# EAGLE design W501D (EAGLE 6.6.0)
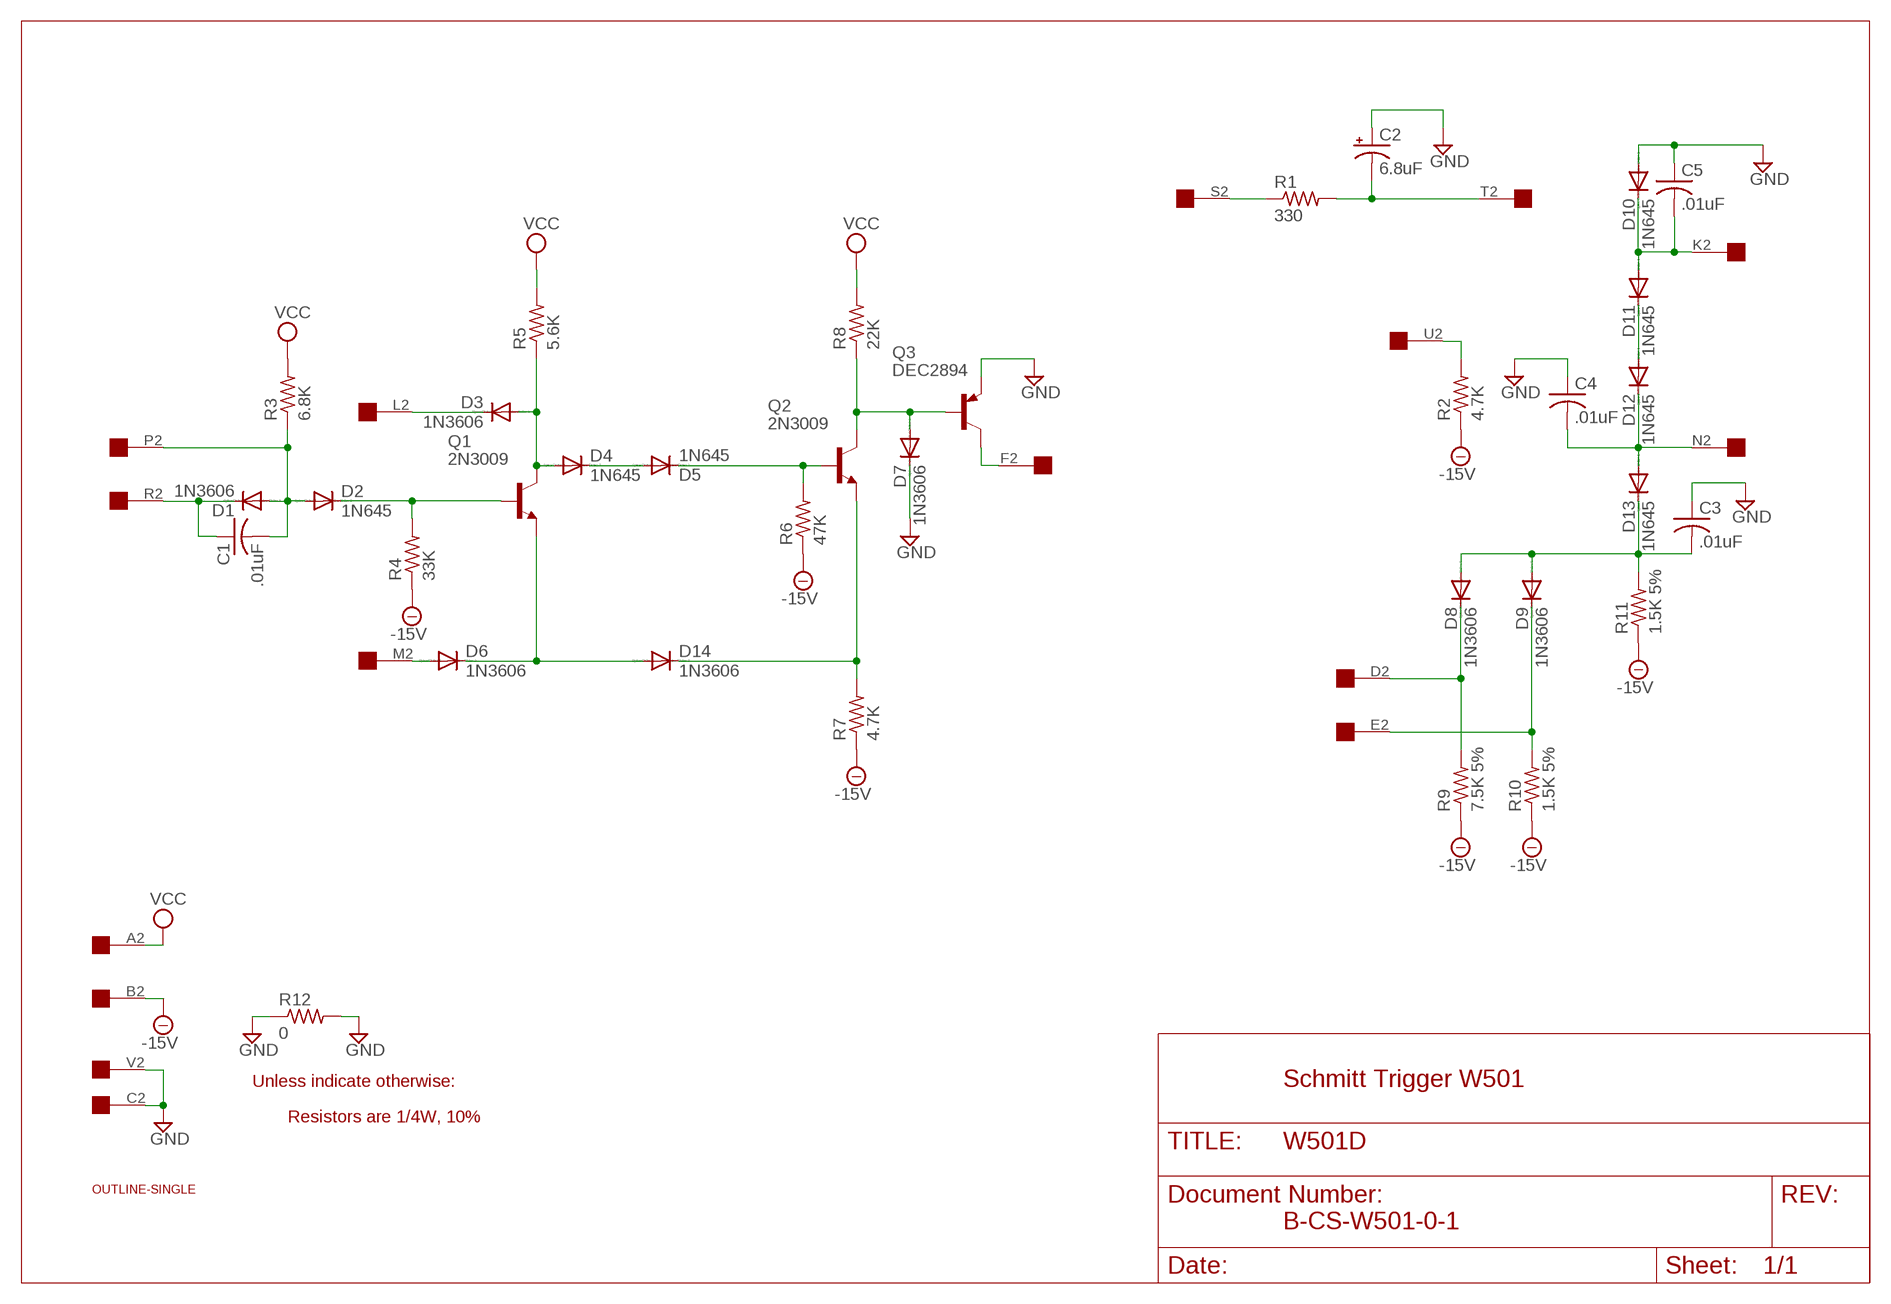
[diagram p0: schematic, sheet 1]

## Parts
C1  .01uF  C-US075-032X103  [C075-032X103]
C2  6.8uF  CPOL-USE20-8AXIAL  [E12-8]
C3  .01uF  C-US  [C063-025X075]
C4  .01uF  C-US  [C063-025X075]
C5  .01uF  C-US  [C063-025X075]
D1  1N3606  1N4148DO35-10  [DO35-10]
D2  1N645  1N4148DO35-10  [DO35-10]
D3  1N3606  1N4148DO35-10  [DO35-10]
D4  1N645  1N4148DO35-10  [DO35-10]
D5  1N645  1N4148DO35-10  [DO35-10]
D6  1N3606  1N4148DO35-10  [DO35-10]
D7  1N3606  1N4148DO35-10  [DO35-10]
D8  1N3606  1N4148DO35-10  [DO35-10]
D9  1N3606  1N4148DO35-10  [DO35-10]
D10  1N645  1N4148DO35-10  [DO35-10]
D11  1N645  1N4148DO35-10  [DO35-10]
D12  1N645  1N4148DO35-10  [DO35-10]
D13  1N645  1N4148DO35-10  [DO35-10]
D14  1N3606  1N4148DO35-10  [DO35-10]
EDGE  EDGE-1  [EDGE-CON1]
Q1  2N3009  2N2102  [TO5]
Q2  2N3009  2N2102  [TO5]
Q3  DEC2894  2N2904  [TO39]
R1  330  R-US_0207/10  [0207/10]
R2  4.7K  R-US_0207/10  [0207/10]
R3  6.8K  R-US_0207/10  [0207/10]
R4  33K  R-US_0207/10  [0207/10]
R5  5.6K  R-US_0207/10  [0207/10]
R6  47K  R-US_0207/10  [0207/10]
R7  4.7K  R-US_0207/10  [0207/10]
R8  22K  R-US_0207/10  [0207/10]
R9  7.5K 5%  R-US_0207/10  [0207/10]
R10  1.5K 5%  R-US_0207/10  [0207/10]
R11  1.5K 5%  R-US_0207/10  [0207/10]
R12  0  R-US_0207/10  [0207/10]
U$1  OUTLINE-SINGLE  [SINGLE]

## Nets
-15V [Supply]: EDGE.B2 R2.1 R4.1 R6.1 R7.1 R9.1 R10.1 R11.1
GND [Supply]: C2.+ C3.1 C4.1 C5.1 D7.C D10.A EDGE.C2 EDGE.V2 Q3.1(E) R12.1 R12.2
N$2: C2.- EDGE.T2 R1.2
N$3: EDGE.S2 R1.1
N$4: C5.2 D10.C D11.A EDGE.K2
N$5: D11.C D12.A
N$6: C4.2 D12.C D13.A EDGE.N2
N$7: C3.2 D8.A D9.A D13.C R11.2
N$8: D8.C EDGE.D2 R9.2
N$9: D9.C EDGE.E2 R10.2
N$10: EDGE.U2 R2.2
N$11: EDGE.F2 Q3.3(C)
N$13: D7.A Q2.3(C) Q3.2(B) R8.1
N$14: D14.C Q2.1(E) R7.2
N$15: D6.C D14.A Q1.1(E)
N$16: D3.A D4.A Q1.3(C) R5.1
N$17: D5.C Q2.2(B) R6.2
N$18: D3.C EDGE.L2
N$19: D6.A EDGE.M2
N$20: C1.2 D1.A D2.A EDGE.P2 R3.1
N$21: C1.1 D1.C EDGE.R2
N$22: D2.C Q1.2(B) R4.2
N$23: D4.C D5.A
VCC [Supply]: EDGE.A2 R3.2 R5.2 R8.2
Unconnected: EDGE.H2 EDGE.J2

## Notes on the sheet
- Unless indicate otherwise: | Schmitt Trigger W501
- Resistors are 1/4W, 10%
- B-CS-W501-0-1

## Library data of the parts
C1 = rcl:C-US: CAPACITOR, American symbol
C2 = dec-con:CPOL-USE20-8AXIAL: A 0.8 inch electrolytic.
C3-C5 = dec-con:C-US: Capacitors with funky DEC lead spacing.
D1-D14 = diode:1N4148: DIODE high speed (Philips)
EDGE = dec-con:EDGE-1: Single-Sided DEC Edge Connector -- (side 2)
Q1 Q2 = transistor-npn:2N2102: NPN Transistor
Q3 = transistor-pnp:2N2904*: PNP Transistror
R1-R12 = rcl:R-US_: RESISTOR, American symbol
U$1 = dec-con:OUTLINE-*: Board outlines for DEC boards.

## Net classes
1 Supply: width 0.813 mm

## Board
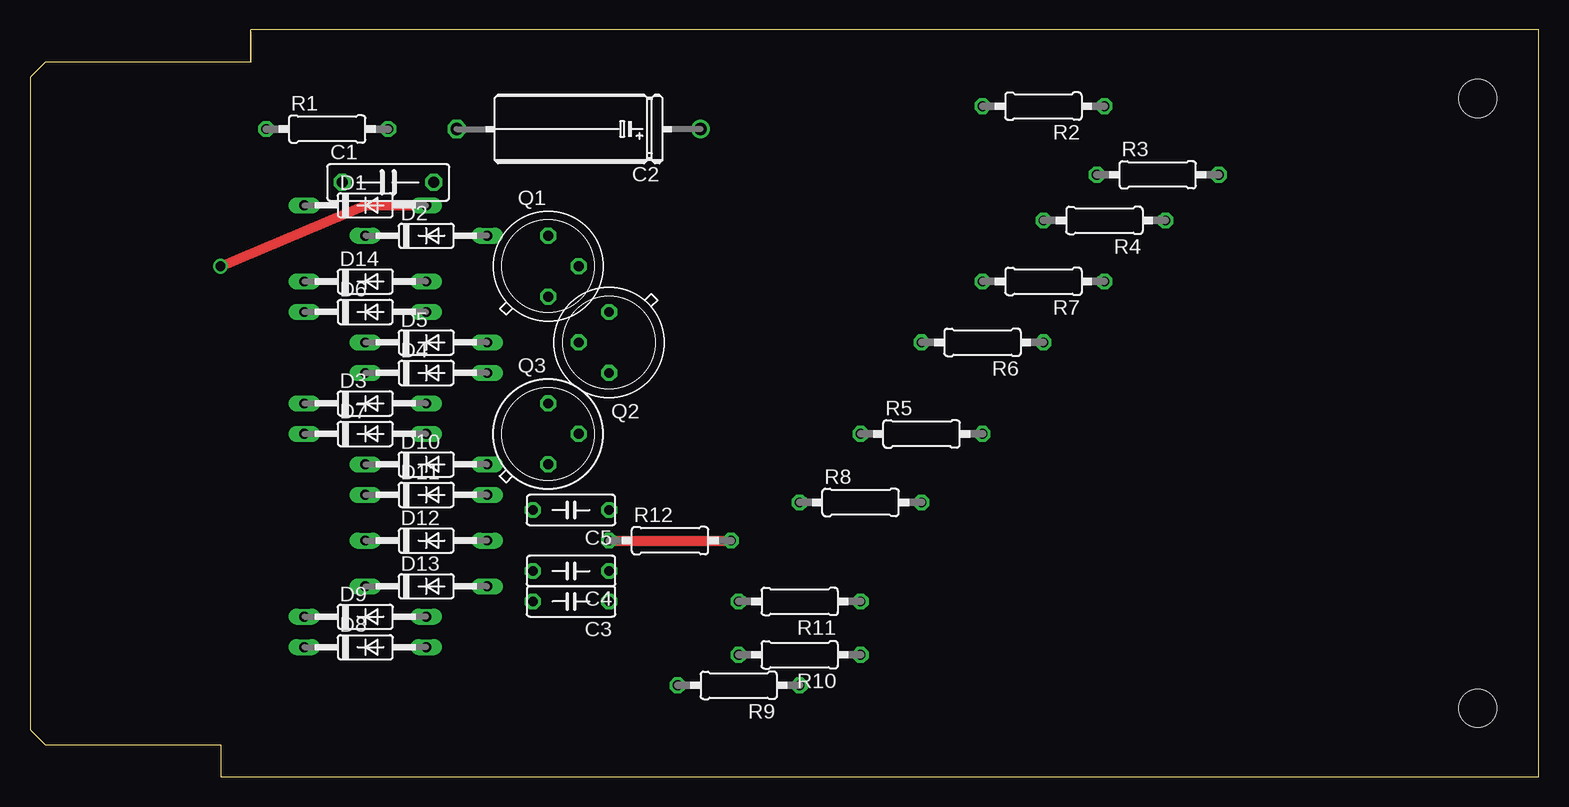
[diagram p1: board, top side]
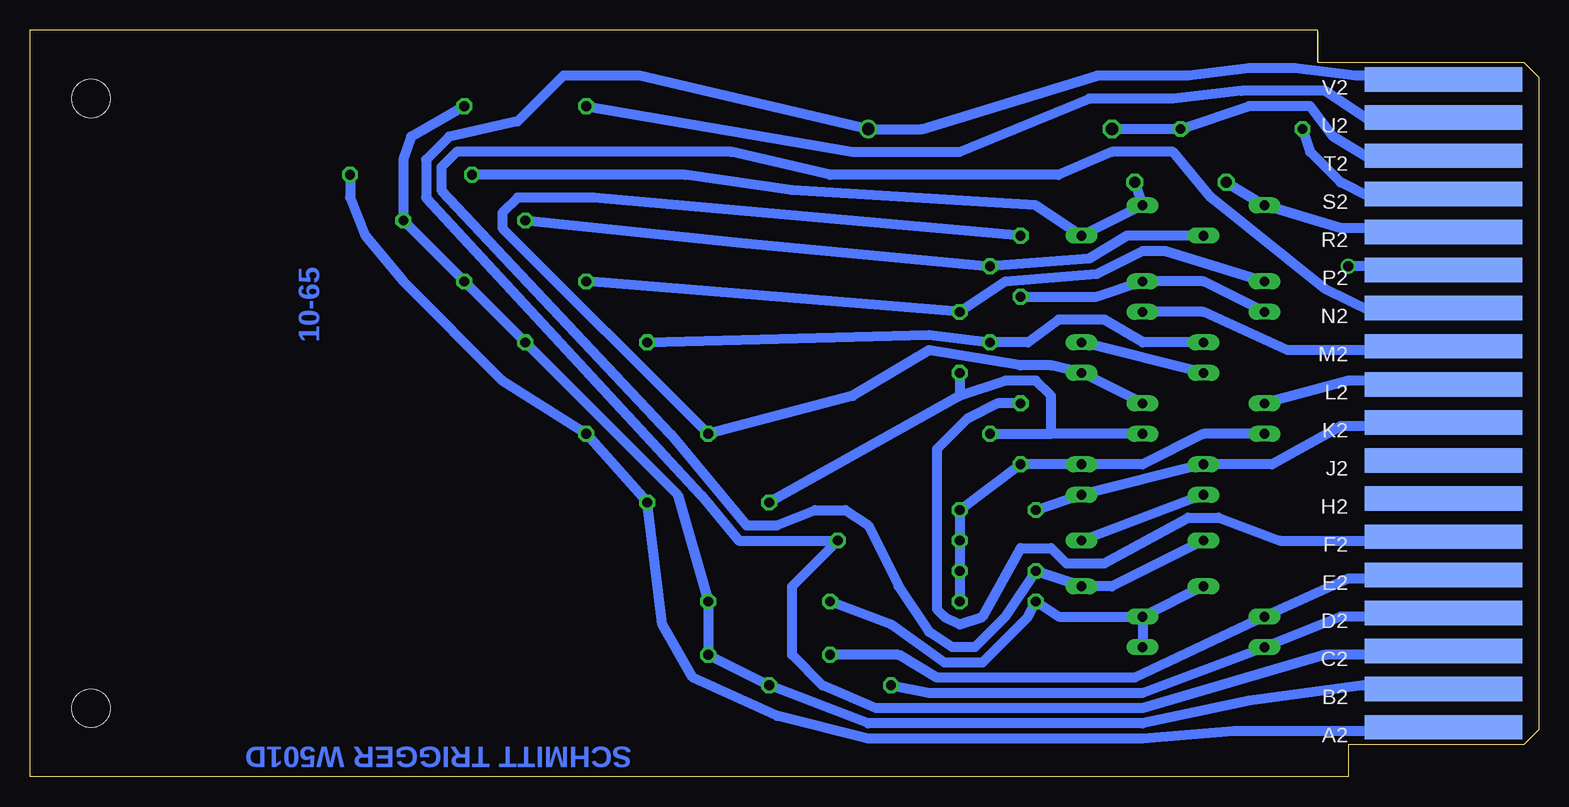
[diagram p2: board, bottom side, seen from below]

Size 125.73 x 62.23 mm. Coordinates in mm from the lower left corner, seen from the top.
Copper layers (1+16): Top 0.035mm / dielectric 1.5mm / Bottom 0.035mm
Design rules "16mils": minimum track width 16mil, minimum drill 32mil, track to track 15mil, track to pad 10mil, pad to pad 10mil, via to via 10mil, smd to smd 10mil, copper to edge 13mil, drill to drill 10mil, minimum pad ring 10mil, minimum via ring 8mil, stop-mask expansion 0mil, vias tented up to drill 0mil, thermal gap 10mil

### Footprints (pad centres in the part's own frame; a part is rotated, then mirrored left to right if it is on the bottom)
C075-032X103 = drill 0.914 octagon: 1 -3.81,0; 2 3.81,0
E12-8 = drill 1.016: + -10.16,0 | drill 1.016 octagon: - 10.16,0
C063-025X075 = drill 0.813 octagon: 1 -2.54,0; 2 3.81,0
DO35-10 = drill 0.813 long: A 5.08,0; C -5.08,0
EDGE-CON1 = smd 13.106 x 2.032 bottom: A2 7.938,4.128; B2 7.938,7.303; C2 7.938,10.477; D2 7.938,13.652; E2 7.938,16.828; F2 7.938,20.003; H2 7.938,23.177; J2 7.938,26.352; K2 7.938,29.527; L2 7.938,32.703; M2 7.938,35.877; N2 7.938,39.053; P2 7.938,42.227; R2 7.938,45.403; S2 7.938,48.578; T2 7.938,51.752; U2 7.938,54.928; V2 7.938,58.102
TO5 = drill 0.813 octagon: 1 0,-2.54; 2 2.54,0; 3 0,2.54
TO39 = drill 0.813 octagon: 1 0,-2.54; 2 2.54,0; 3 0,2.54
0207/10 = drill 0.813 octagon: 1 -5.08,0; 2 5.08,0
SINGLE = hole 3.175: 120.65,56.515; 120.65,5.715

### Placement (x,y rotation side)
C1  29.85,49.53 0 top
C2  45.72,53.98 180 top
C3  45.72,14.61 180 top
C4  45.72,17.14 180 top
C5  45.72,22.23 180 top
D1  27.94,47.62 0 top
D2  33.02,45.09 0 top
D3  27.94,31.11 0 top
D4  33.02,33.66 0 top
D5  33.02,36.2 0 top
D6  27.94,38.73 0 top
D7  27.94,28.57 0 top
D8  27.94,10.79 0 top
D9  27.94,13.34 0 top
D10  33.02,26.04 0 top
D11  33.02,23.5 0 top
D12  33.02,19.68 0 top
D13  33.02,15.88 0 top
D14  27.94,41.27 0 top
EDGE  0,0 0 top
Q1  43.18,42.55 0 top
Q2  48.26,36.2 180 top
Q3  43.18,28.57 0 top
R1  24.77,53.98 0 top
R2  84.46,55.88 180 top
R3  93.98,50.16 0 top
R4  89.54,46.35 180 top
R5  74.3,28.57 0 top
R6  79.38,36.2 180 top
R7  84.46,41.27 180 top
R8  69.22,22.86 0 top
R9  59.06,7.62 180 top
R10  64.14,10.16 180 top
R11  64.14,14.61 180 top
R12  53.34,19.68 0 top
U$1  0,0 0 top

### Tracks (layer width: path | path; a pad name or v marks a point on that pad's centre or on a via)
-15V
  Bottom 0.813: EDGE.B2 8.89,7.62 14.61,7.62 24.13,6.35 33.02,4.45 55.88,4.45 R9.1 R10.1 R11.1 71.76,23.5 R6.1 R7.1 R4.1 94.62,51.44 93.98,53.34 R2.1
GND
  Top 0.813: R12.1 R12.2
  Bottom 0.813: C3.1 C4.1 R12.1 C5.1 Q3.1 D10.A 33.02,26.04 27.94,28.57 D7.C | EDGE.C2 8.89,10.16 17.78,10.16 33.02,5.71 55.25,5.71 59.69,7.62 62.23,10.16 62.23,15.88 R12.2 66.68,19.68 69.85,23.5 92.71,48.26 92.71,51.44 90.81,53.34 85.09,54.61 81.28,58.42 74.93,58.42 C2.+ 51.44,53.98 36.83,58.42 29.21,58.42 24.13,59.05 20.32,59.05 15.24,58.42 8.89,58.42 EDGE.V2
N$2
  Bottom 0.813: EDGE.T2 8.26,51.44 13.97,51.44 17.15,53.34 19.05,55.88 24.13,55.88 R1.2 C2.-
N$3
  Bottom 0.813: EDGE.S2 8.89,48.26 13.97,48.26 16.51,49.53 19.05,52.07 R1.1
N$4
  Bottom 0.813: C5.2 D11.A D10.C 22.23,26.04 16.51,29.21 8.89,29.21 EDGE.K2
N$5
  Bottom 0.813: D11.C D12.A
N$6
  Bottom 0.813: EDGE.N2 9.53,39.05 9.53,38.73 13.97,38.73 17.78,40.64 27.31,48.26 30.48,52.07 35.56,52.07 40.01,50.16 59.06,50.16 67.31,52.07 90.17,52.07 91.44,50.8 91.44,48.9 72.39,28.57 66.04,20.95 63.5,20.95 60.33,22.23 57.79,22.23 55.88,20.95 53.34,15.88 50.8,12.06 48.9,10.79 46.99,10.79 44.45,13.34 C4.2 D13.A 35.56,15.88 D12.C
N$7
  Bottom 0.813: D13.C D9.A | D9.A 40.01,13.34 C3.2 42.55,13.34 46.36,9.53 49.53,9.53 53.98,12.7 R11.2 | D9.A D8.A
N$8
  Bottom 0.813: EDGE.D2 8.89,13.34 16.51,13.34 D8.C 33.02,6.99 50.8,6.99 R9.2
N$9
  Bottom 0.813: EDGE.E2 10.16,16.51 15.88,16.51 D9.C 33.66,8.26 50.17,8.26 53.34,10.16 R10.2
N$10
  Bottom 0.813: EDGE.U2 8.26,54.61 13.97,54.61 17.78,57.15 24.77,57.15 30.48,56.52 37.47,56.52 48.26,52.07 57.15,52.07 R2.2
N$11
  Bottom 0.813: Q3.3 45.09,31.11 47.63,29.84 50.17,27.3 50.17,13.97 49.53,13.34 48.26,12.7 46.36,13.34 43.18,19.05 40.64,19.05 39.37,17.78 36.2,17.78 29.21,21.59 26.67,21.59 21.59,19.68 8.89,19.68 EDGE.F2
N$13
  Bottom 0.813: Q2.3 48.26,31.75 | 48.26,31.75 R8.1 | Q3.2 40.64,28.57 | 40.64,28.57 40.64,31.75 41.91,33.02 44.45,33.02 48.26,31.75 | D7.A 40.64,28.57
N$14
  Bottom 0.813: R7.2 Q2.1 44.45,41.27 36.83,41.91 33.02,43.81 31.12,43.81 D14.C
N$15
  Bottom 0.813: D6.C 27.94,41.27 D14.A 36.83,40.01 Q1.1
N$16
  Bottom 0.813: Q1.3 78.74,48.26 85.09,48.26 86.36,46.99 86.36,45.72 R5.1 57.15,31.75 50.8,35.56 43.18,34.29 40.64,34.29 D4.A D3.A
N$17
  Bottom 0.813: R6.2 50.8,36.83 Q2.2 42.55,36.2 40.01,38.1 36.2,38.1 33.02,36.2 D5.C
N$18
  Bottom 0.813: EDGE.L2 8.89,33.02 15.88,33.02 D3.C
N$19
  Bottom 0.813: EDGE.M2 8.89,35.56 20.96,35.56 27.94,38.73 D6.A
N$20  (via drill 0.81)
  Top 0.813: v15.88,42.55 27.94,47.62 D1.A
  Bottom 0.813: C1.2 D1.A D2.A 41.91,47.62 62.23,48.9 71.12,50.16 R3.1 | EDGE.P2 8.89,42.55 v15.88,42.55
N$21
  Bottom 0.813: EDGE.R2 8.89,45.72 16.51,45.72 D1.C C1.1
N$22
  Bottom 0.813: R4.2 66.04,44.45 Q1.2 37.47,43.18 34.29,45.09 D2.C
N$23
  Bottom 0.813: D4.C D5.A
VCC
  Bottom 0.813: EDGE.A2 8.89,3.81 25.4,3.81 33.02,3.17 55.88,3.17 63.5,5.08 70.49,8.26 73.03,12.7 R8.2 R5.2 86.36,33.02 94.62,41.27 97.79,45.09 99.06,48.26 R3.2

### Text on the board
Bottom: 10-65 | SCHMITT TRIGGER W501D
200bmp: C:/Users/Vince/Documents/eagle/projects/DEC/Wxxx/W501/W501Dbackfb.bmp